# EAGLE design hddj-2.0 (EAGLE 4.16)
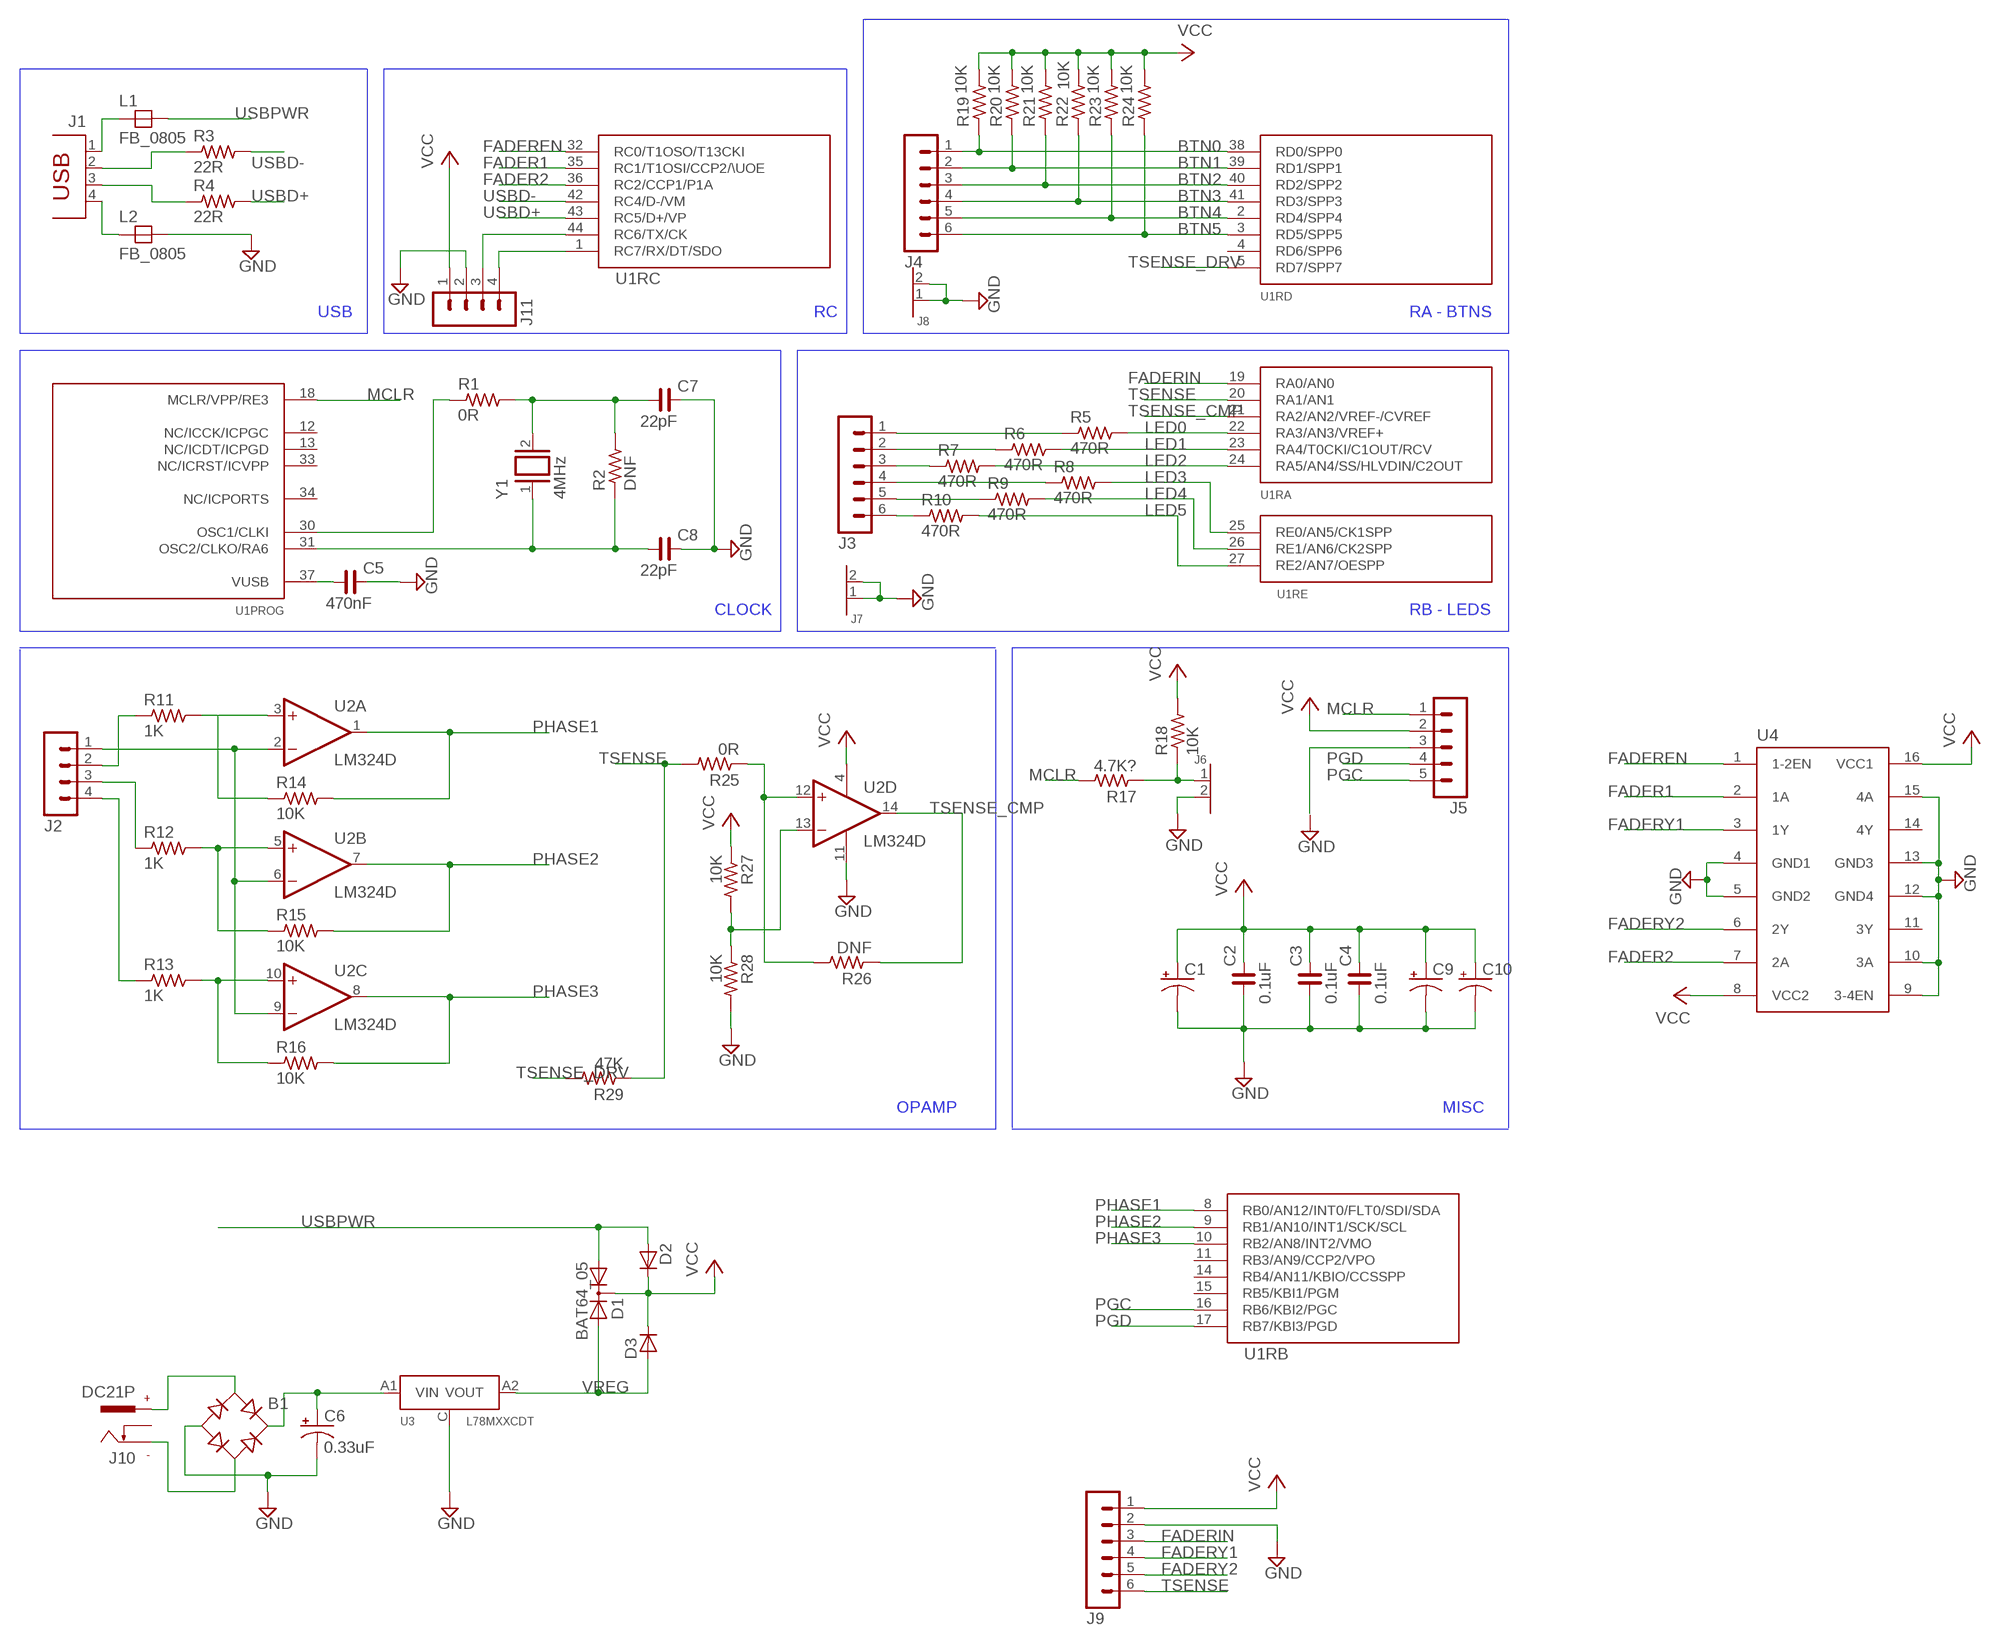
[diagram p0: schematic, sheet 1]

## Parts
B1  RB1A  [RB1A]
C1  CPOL-USCT3216  [CT3216]
C2  0.1uF  C_0805  [C0805]
C3  0.1uF  C_0805  [C0805]
C4  0.1uF  C_0805  [C0805]
C5  470nF  C_0805  [C0805]
C6  0.33uF  CPOL-USB/3528-21R  [B/3528-21R]
C7  22pF  C_0805  [C0805]
C8  22pF  C_0805  [C0805]
C9  CPOL-USCT3216  [CT3216]
C10  CPOL-USCT3216  [CT3216]
D1  BAT64_05  DIODE-2AC|CASOT23  [SOT23]
D2  D-SMB  [SMB]
D3  D-SMB  [SMB]
J1  PN61729  [PN61729]
J2  MA04-1  [MA04-1]
J3  MA06-1  [MA06-1]
J4  MA06-1  [MA06-1]
J5  MA05-1  [MA05-1]
J6  PINHDR2  [1X02]
J7  PINHDR2  [1X02]
J8  PINHDR2  [1X02]
J9  MA06-1  [MA06-1]
J10  DC21P  [DCSKTP]
J11  MA04-1  [MA04-1]
L1  FB_0805  [L0805]
L2  FB_0805  [L0805]
R1  0R  R_0805  [R0805]
R2  DNF  R_0805  [R0805]
R3  22R  R_0805  [R0805]
R4  22R  R_0805  [R0805]
R5  470R  R_0805  [R0805]
R6  470R  R_0805  [R0805]
R7  470R  R_0805  [R0805]
R8  470R  R_0805  [R0805]
R9  470R  R_0805  [R0805]
R10  470R  R_0805  [R0805]
R11  1K  R_0805  [R0805]
R12  1K  R_0805  [R0805]
R13  1K  R_0805  [R0805]
R14  10K  R_0805  [R0805]
R15  10K  R_0805  [R0805]
R16  10K  R_0805  [R0805]
R17  4.7K?  R_0805  [R0805]
R18  10K  R_0805  [R0805]
R19  10K  R_0805  [R0805]
R20  10K  R_0805  [R0805]
R21  10K  R_0805  [R0805]
R22  10K  R_0805  [R0805]
R23  10K  R_0805  [R0805]
R24  10K  R_0805  [R0805]
R25  0R  R_0805  [R0805]
R26  DNF  R_0805  [R0805]
R27  10K  R_0805  [R0805]
R28  10K  R_0805  [R0805]
R29  47K  R_0805  [R0805]
U1  PIC18F4550PT  [PQFP-44]
U2  LM324D  [SO14]
U3  L78MXXCDT  [DPACK_3]
U4  L293E  [DIL16]
Y1  4MHz  XTAL/S  [QS]

## Nets
BTN0: J4.1 R19.1 U1.38(RD:RD0/SPP0)
BTN1: J4.2 R20.1 U1.39(RD:RD1/SPP1)
BTN2: J4.3 R21.1 U1.40(RD:RD2/SPP2)
BTN3: J4.4 R22.1 U1.41(RD:RD3/SPP3)
BTN4: J4.5 R23.1 U1.2(RD:RD4/SPP4)
BTN5: J4.6 R24.1 U1.3(RD:RD5/SPP5)
FADER1: U1.35(RC:RC1/T1OSI/CCP2/\UOE) U4.2(1A)
FADER2: U1.36(RC:RC2/CCP1/P1A) U4.7(2A)
FADEREN: U1.32(RC:RC0/T1OSO/T13CKI) U4.1(1-2EN)
FADERIN: J9.3 U1.19(RA:RA0/AN0)
FADERY1: J9.4 U4.3(1Y)
FADERY2: J9.5 U4.6(2Y)
GND: B1.- C1.- C2.1 C3.1 C4.1 C5.2 C6.- C7.2 C8.2 C9.- C10.- J5.3 J6.2 J7.1 J7.2 J8.1 J8.2 J9.2 J11.2 L2.2 R28.2 U2.11(P:V-) U3.C(GND) U4.4(GND1) U4.5(GND2) U4.9(3-4EN) U4.10(3A) U4.12(GND4) U4.13(GND3) U4.15(4A)
LED0: R5.2 U1.22(RA:RA3/AN3/VREF+)
LED1: R6.2 U1.23(RA:RA4/T0CKI/C1OUT/RCV)
LED2: R7.2 U1.24(RA:RA5/AN4/SS/HLVDIN/C2OUT)
LED3: R8.2 U1.25(RE:RE0/AN5/CK1SPP)
LED4: R9.2 U1.26(RE:RE1/AN6/CK2SPP)
LED5: R10.2 U1.27(RE:RE2/AN7/OESPP)
MCLR: J5.1 R17.2 U1.18(PROG:MCLR/VPP/RE3)
N$1: J3.6 R10.1
N$2: R1.1 U1.30(PROG:OSC1/CLKI)
N$3: J3.5 R9.1
N$4: J3.4 R8.1
N$5: J3.3 R7.1
N$6: J3.2 R6.1
N$7: J3.1 R5.1
N$8: J6.1 R17.1 R18.1
N$9: J11.4 U1.1(RC:RC7/RX/DT/SDO)
N$10: J11.3 U1.44(RC:RC6/TX/CK)
N$11: R13.2 R16.1 U2.10(C:+IN)
N$12: R12.2 R15.1 U2.5(B:+IN)
N$13: R27.2 R28.1 U2.13(D:-IN)
N$14: C7.1 R1.2 R2.2 Y1.2
N$15: C8.1 R2.1 U1.31(PROG:OSC2/CLKO/RA6) Y1.1
N$16: C5.1 U1.37(PROG:VUSB)
N$17: J2.1 U2.2(A:-IN) U2.6(B:-IN) U2.9(C:-IN)
N$18: J1.4 L2.1
N$19: J2.2 R11.1
N$20: J2.3 R12.1
N$21: J2.4 R13.1
N$22: J1.3 R4.1
N$23: R25.1 R26.2 U2.12(D:+IN)
N$27: B1.AC1 J10.+
N$28: B1.AC2 J10.-
N$29: J1.2 R3.1
N$30: J1.1 L1.1
N$31: B1.+ C6.+ U3.A1(VIN)
N$55: R11.2 R14.1 U2.3(A:+IN)
PGC: J5.5 U1.16(RB:RB6/KBI2/PGC)
PGD: J5.4 U1.17(RB:RB7/KBI3/PGD)
PHASE1: R14.2 U1.8(RB:RB0/AN12/INT0/FLT0/SDI/SDA) U2.1(A:OUT)
PHASE2: R15.2 U1.9(RB:RB1/AN10/INT1/SCK/SCL) U2.7(B:OUT)
PHASE3: R16.2 U1.10(RB:RB2/AN8/INT2/VMO) U2.8(C:OUT)
TSENSE: J9.6 R25.2 R29.1 U1.20(RA:RA1/AN1)
TSENSE_CMP: R26.1 U1.21(RA:RA2/AN2/VREF-/CVREF) U2.14(D:OUT)
TSENSE_DRV: R29.2 U1.5(RD:RD7/SPP7)
USBD+: R4.2 U1.43(RC:RC5/D+/VP)
USBD-: R3.2 U1.42(RC:RC4/D-/VM)
USBPWR: D1.1(A1) D2.2(A) L1.2
VCC: C1.+ C2.2 C3.2 C4.2 C9.+ C10.+ D1.3(C) D2.1(C) D3.1(C) J5.2 J9.1 J11.1 R18.2 R19.2 R20.2 R21.2 R22.2 R23.2 R24.2 R27.1 U2.4(P:V+) U4.8(VCC2) U4.16(VCC1)
VREG: D1.2(A2) D3.2(A) U3.A2(VOUT)
Unconnected: J10.C U1.4(RD:RD6/SPP6) U1.11(RB:RB3/AN9/CCP2/VPO) U1.12(PROG:NC/ICCK/ICPGC) U1.13(PROG:NC/ICDT/ICPGD) U1.14(RB:RB4/AN11/KBIO/CCSSPP) U1.15(RB:RB5/KBI1/PGM) U1.33(PROG:NC/ICRST/ICVPP) U1.34(PROG:NC/ICPORTS) U4.11(3Y) U4.14(4Y)

## Notes on the sheet
- USB | RC | RA - BTNS
- CLOCK | RB - LEDS
- OPAMP | MISC

## Power pins joined to a net without a drawn wire
GND: U1.6(GND) U1.29(GND)
VCC: U1.7(VCC) U1.28(VCC)

## Library data of the parts
B1 = rectifier:RB1A: RECTIFIER 1 A
C1 C6 C9 C10 = rcl:CPOL-US: POLARIZED CAPACITOR, American symbol
C2-C5 C7 C8 = rc-master:C_: NON-POLARIZED CAP
D1 = diode:DIODE-2AC|CA: Dual DIODE Anode-Cathode|Cathode-Anode
D2 D3 = semicon-smd-ipc:D-: DIODE unfilled
J1 = con-berg:PN61729: BERG USB connector
J2 J11 = con-lstb:MA04-1: PIN HEADER
J3 J4 J9 = con-lstb:MA06-1: PIN HEADER
J5 = con-lstb:MA05-1: PIN HEADER
J6-J8 = dongle:PINHDR2
J10 = dcsocket:DC21P: DC 2.1 mm Power Socket Positive Centre
L1 L2 = rc-master:FB_: FERRITE BEAD
R1-R29 = rc-master:R_: RESISTOR
U1 = dongle:PIC18F4550
U2 = linear:LM324: OP AMP
U3 = dongle:L78MXX
U4 = texas:L293E: TI DEVICE
Y1 = special:XTAL/S: CRYSTAL

## Board
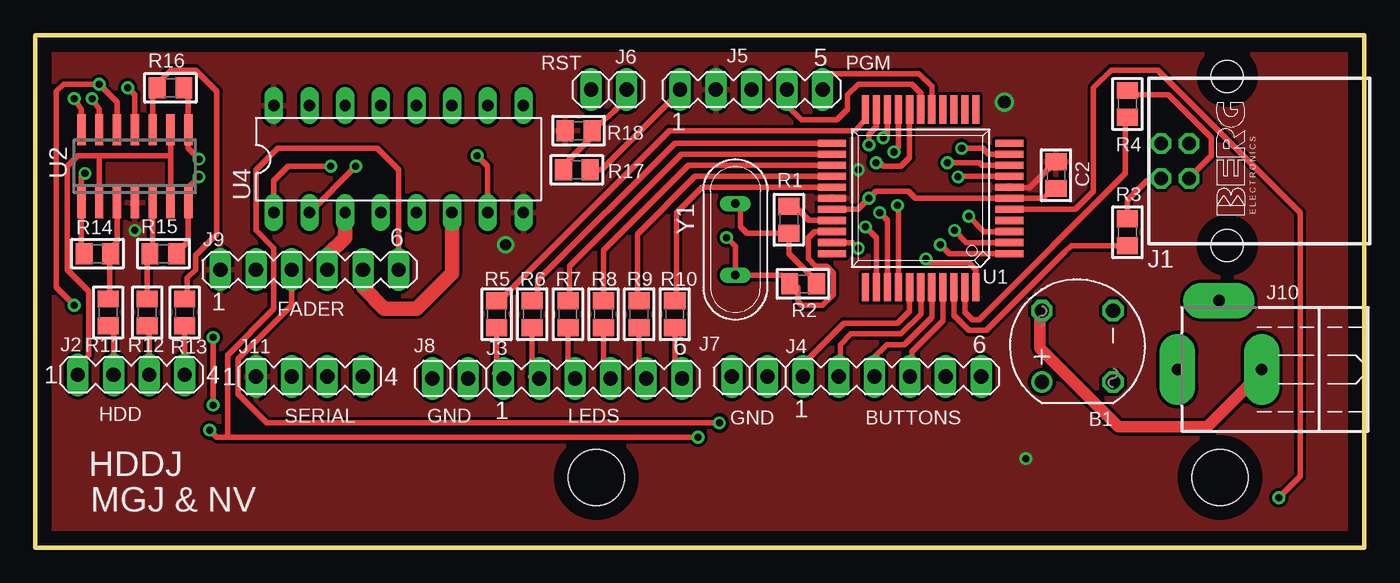
[diagram p1: board, top side]
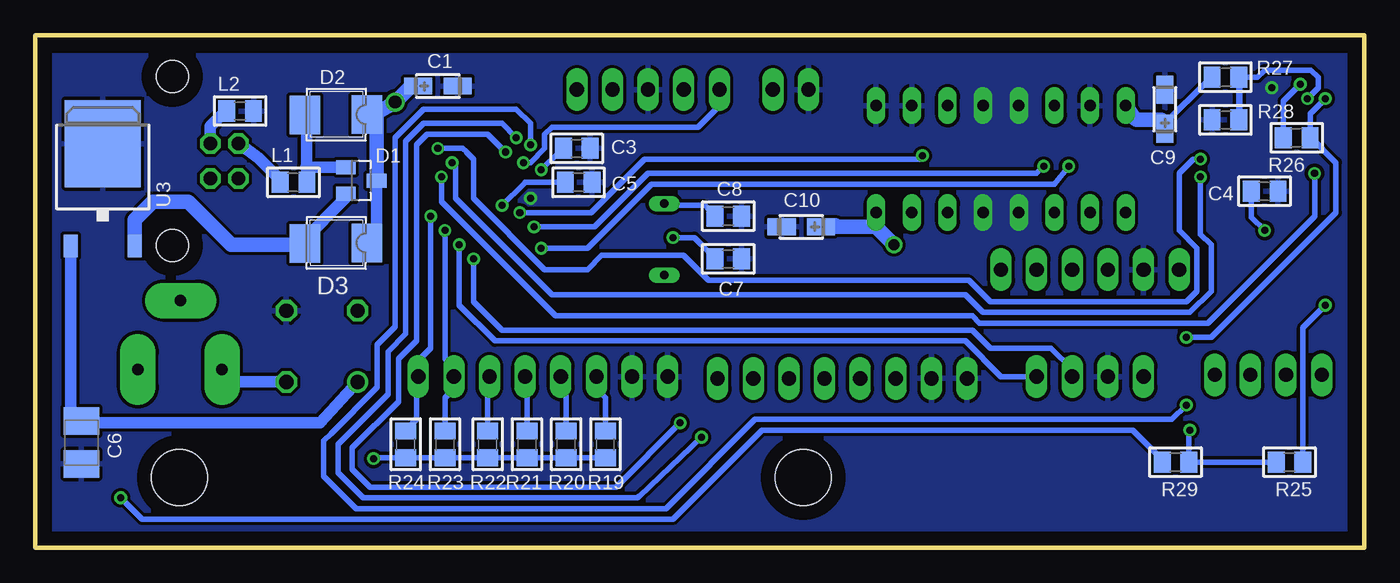
[diagram p2: board, bottom side, seen from below]

Size 94.75 x 36.52 mm. Coordinates in mm from the lower left corner, seen from the top.
Outline: 0,0 0,36.52 94.75,36.52 94.75,0 0,0
Copper layers (1*16): Top 0.035mm / dielectric 1.5mm / Bottom 0.035mm
Design rules "default": minimum track width 10mil, minimum drill 12mil, track to track 9mil, track to pad 9mil, pad to pad 9mil, via to via 9mil, smd to smd 8mil, copper to edge 40mil, drill to drill 8mil, minimum pad ring 10mil, minimum via ring 8mil, stop-mask expansion 4mil, vias tented up to drill 0mil, thermal gap 10mil
Holes 4 mm at 40,5 84.45,5

### Footprints (pad centres in the part's own frame; a part is rotated, then mirrored left to right if it is on the bottom)
RB1A = drill 1.016 round: + -2.54,2.54 | drill 1.016 octagon: - 2.54,-2.54; AC1 2.54,2.54; AC2 -2.54,-2.54
CT3216 = smd 2 x 1.2: + 1.4,0; - -1.4,0
C0805 = smd 1.2 x 1.5: 1 -0.953,0; 2 0.953,0
B/3528-21R = smd 1.95 x 2.5: + 1.525,0; - -1.525,0
SOT23 = smd 1 x 1.4: 1 -0.95,-1.1; 2 0.95,-1.1; 3 0,1.1
SMB = smd 2.159 x 2.743: 1 -2.311,-0.127; 2 2.108,-0.102
PN61729 = drill 0.95 octagon: 1 1.25,4.71; 2 -1.25,4.71; 3 -1.25,2.71; 4 1.25,2.71 | hole 2.3: -6.02,0; 6.02,0
MA04-1 = drill 1.016 long: 1 -3.81,0; 2 -1.27,0; 3 1.27,0; 4 3.81,0
MA06-1 = drill 1.016 long: 1 -6.35,0; 2 -3.81,0; 3 -1.27,0; 4 1.27,0; 5 3.81,0; 6 6.35,0
MA05-1 = drill 1.016 long: 1 -5.08,0; 2 -2.54,0; 3 0,0; 4 2.54,0; 5 5.08,0
1X02 = drill 1.016 long: 1 -1.27,0; 2 1.27,0
DCSKTP = drill 0.813 pad 2.54 long: + -1.27,0.08; - -1.27,6.08; C 3.63,3.13
L0805 = smd 1.2 x 1.5: 1 -0.953,0; 2 0.953,0
R0805 = smd 1.2 x 1.5: 1 -0.953,0; 2 0.953,0
PQFP-44 = smd 0.508 x 2.007: 1 -3.937,-6.706; 2 -3.15,-6.706; 3 -2.362,-6.706; 4 -1.575,-6.706; 5 -0.787,-6.706; 6 0,-6.706; 7 0.787,-6.706; 8 1.575,-6.706; 9 2.362,-6.706; 10 3.15,-6.706; 11 3.937,-6.706; 23 3.937,5.944; 24 3.15,5.944; 25 2.362,5.944; 26 1.575,5.944; 27 0.787,5.944; 28 0,5.944; 29 -0.787,5.944; 30 -1.575,5.944; 31 -2.362,5.944; 32 -3.15,5.944; 33 -3.937,5.944 | smd 2.007 x 0.508: 12 6.325,-4.318; 13 6.325,-3.531; 14 6.325,-2.743; 15 6.325,-1.956; 16 6.325,-1.168; 17 6.325,-0.381; 18 6.325,0.406; 19 6.325,1.194; 20 6.325,1.981; 21 6.325,2.769; 22 6.325,3.556; 34 -6.325,3.556; 35 -6.325,2.769; 36 -6.325,1.981; 37 -6.325,1.194; 38 -6.325,0.406; 39 -6.325,-0.381; 40 -6.325,-1.168; 41 -6.325,-1.956; 42 -6.325,-2.743; 43 -6.325,-3.531; 44 -6.325,-4.318
SO14 = smd 0.6 x 2.2: 1 -3.81,-2.6; 2 -2.54,-2.6; 3 -1.27,-2.6; 4 0,-2.6; 5 1.27,-2.6; 6 2.54,-2.6; 7 3.81,-2.6; 8 3.81,2.6; 9 2.54,2.6; 10 1.27,2.6; 11 0,2.6; 12 -1.27,2.6; 13 -2.54,2.6; 14 -3.81,2.6
DPACK_3 = smd 1 x 1.6: A1 -2.28,-4.8; A2 2.28,-4.8 | smd 5.4 x 6.2: C 0,2.5
DIL16 = drill 0.813 long: 1 -8.89,-3.81; 2 -6.35,-3.81; 3 -3.81,-3.81; 4 -1.27,-3.81; 5 1.27,-3.81; 6 3.81,-3.81; 7 6.35,-3.81; 8 8.89,-3.81; 9 8.89,3.81; 10 6.35,3.81; 11 3.81,3.81; 12 1.27,3.81; 13 -1.27,3.81; 14 -3.81,3.81; 15 -6.35,3.81; 16 -8.89,3.81
QS = drill 0.61 long: 1 -2.54,0; 2 2.54,0

### Placement (x,y rotation side)
B1  74.3,14.35 90 top
C1  66.04,32.89 180 bottom
C2  72.77,26.54 90 top
C3  56.13,28.45 180 bottom
C4  7.11,25.4 180 bottom
C5  56.01,26.04 0 bottom
C6  91.44,7.49 90 bottom
C7  45.34,23.62 0 bottom
C8  45.34,20.57 0 bottom
C9  14.22,31.24 270 bottom
C10  40.13,22.86 0 bottom
D1  71.5,26.16 270 bottom
D2  73.41,30.73 180 bottom
D3  73.41,21.59 180 bottom
J1  84.96,27.56 90 top
J2  6.86,12.32 0 top
J3  39.75,12.06 0 top
J4  61.09,12.19 0 top
J5  51.05,32.64 0 top
J6  40.89,32.64 180 top
J7  50.93,12.19 0 top
J8  29.59,12.06 0 top
J9  19.56,19.81 0 top
J10  87.5,13.97 90 top
J11  19.56,12.19 0 top
L1  76.33,26.04 0 bottom
L2  80.14,31.11 0 bottom
R1  53.72,23.37 270 top
R2  54.74,18.8 0 top
R3  77.85,22.48 270 top
R4  77.85,31.62 270 top
R5  32.89,16.64 90 top
R6  35.43,16.64 90 top
R7  37.97,16.64 90 top
R8  40.51,16.64 90 top
R9  43.05,16.64 90 top
R10  45.59,16.64 90 top
R11  5.21,16.76 90 top
R12  8,16.76 90 top
R13  10.67,16.76 90 top
R14  4.45,20.95 180 top
R15  9.14,20.95 0 top
R16  9.65,32.77 0 top
R17  38.61,26.92 0 top
R18  38.73,29.72 180 top
R19  54.1,7.37 270 bottom
R20  56.9,7.37 270 bottom
R21  59.69,7.37 270 bottom
R22  62.48,7.37 270 bottom
R23  65.53,7.37 270 bottom
R24  68.33,7.37 270 bottom
R25  5.33,6.1 180 bottom
R26  4.83,29.21 180 bottom
R27  9.91,33.53 0 bottom
R28  9.91,30.48 180 bottom
R29  13.46,6.1 180 bottom
U1  62.74,24.89 90 top
U2  7.11,27.18 0 top
U3  89.92,26.29 0 bottom
U4  25.91,27.69 0 top
Y1  49.91,21.97 90 top

### Tracks (layer width: path | path; a pad name or v marks a point on that pad's centre or on a via)
BTN0
  Top 0.406: U1.38 62.33,16.87 61.47,16 57.66,16 55.12,13.46 54.86,12.45 54.61,12.19 J4.1
  Bottom 0.406: R19.1 54.1,10.67 54.61,11.18 54.61,11.94 54.86,12.19 J4.1
BTN1
  Top 0.406: U1.39 63.12,16.64 61.72,15.24 58.17,15.24 57.4,14.48 57.4,12.45 57.28,12.32 J4.2
  Bottom 0.406: R20.1 56.9,11.18 57.15,11.43 57.15,12.19 J4.2
BTN2
  Top 0.406: J4.3 59.94,12.19 59.94,12.7 59.69,13.46 | 59.69,13.46 59.69,12.95 | U1.40 63.91,16.41 61.98,14.48 60.71,14.48 59.69,13.46
  Bottom 0.406: 59.82,12.32 59.94,12.45 | 59.82,12.32 J4.3 | R21.1 59.69,12.19 59.82,12.32
BTN3
  Top 0.406: 62.48,12.45 62.36,12.32 J4.4 62.36,12.06 62.48,11.94 62.48,13.97 64.69,16.18 U1.41
  Bottom 0.406: J4.4 62.23,12.19 62.48,11.94 R22.1
BTN4  (via drill 0.5)
  Top 0.406: U1.2 66.4,21.74 v65.53,22.61
  Bottom 0.406: R23.1 65.53,10.67 64.77,11.43 64.77,11.94 65.02,12.19 | 65.02,12.19 J4.5 | 65.02,12.19 65.02,12.7 65.28,12.95 65.28,13.21 65.53,13.46 v65.53,22.61
BTN5  (via drill 0.5)
  Top 0.406: U1.3 67.64,22.53 v66.55,23.62
  Bottom 0.406: 67.56,12.45 67.44,12.32 J4.6 67.44,12.06 67.31,11.94 67.56,11.68 67.56,9.14 68.33,8.38 R24.1 | 67.56,12.45 67.56,11.43 | 67.56,12.45 67.56,13.21 66.55,14.22 v66.55,23.62
FADER1  (via drill 0.5)
  Top 0.406: U1.35 59.97,22.07 v59.18,22.86 | U4.2 v22.86,27.18
  Bottom 0.406: v59.18,22.86 54.86,22.86 51.05,26.67 23.37,26.67 v22.86,27.18
FADER2  (via drill 0.5)
  Top 0.406: U1.36 60.76,23.32 v60.2,23.88 | U4.7 32.26,27.18 v31.5,27.94
  Bottom 0.406: v60.2,23.88 55.12,23.88 51.31,27.69 31.5,27.69 v31.5,27.94
FADEREN  (via drill 0.5)
  Top 0.406: U1.32 58.27,21.74 v58.67,21.34 | 17.27,23.88 17.27,23.11 U4.1 17.02,26.16 18.03,27.18 v21.08,27.18
  Bottom 0.406: v58.67,21.34 55.37,21.34 50.8,25.91 22.1,25.91 v21.08,27.18
FADERIN  (via drill 0.5)
  Top 0.406: U1.19 61.54,28.52 v61.21,28.19 | v48.77,8.89 16.51,8.89 14.48,10.92 14.48,13.46 18.29,17.27 J9.3
  Bottom 0.406: v61.21,28.19 62.48,29.46 66.8,29.46 67.56,28.7 67.56,14.73 68.83,13.46 68.83,10.41 72.14,7.11 72.14,5.59 70.87,4.32 53.34,4.32 v48.77,8.89
FADERY1
  Top 1.016: U4.3 22.1,22.1 20.83,20.83 20.83,20.07 21.08,19.81 J9.4
FADERY2
  Top 1.016: J9.5 23.37,18.54 24.89,17.02 27.18,17.02 29.72,19.56 U4.6 29.72,23.11
GND  (via drill 0.5)
  Top 0.406: U1.29 58.65,24.11 v59.44,24.89 59.94,25.4 62.23,25.4 62.74,24.89 U1.6 71.88,24.89 72.58,25.59 C2.1 | U2.11 7.11,32.26 v6.6,32.77
  pour Bottom: -0.25,35.05 0,0 94.61,0 94.61,35.05
  pour Bottom (no thermals): 23.37,33.27 23.37,20.57 28.45,20.57 28.45,33.27 28.19,33.53 23.62,33.53
LED0
  Top 0.406: 32.89,17.4 32.77,17.27 | R5.2 32.89,17.4 | 32.89,17.4 45.21,29.72 58.42,29.72 59.18,30.48 U1.22 59.18,31.24
LED1
  Top 0.406: R6.2 35.43,17.65 35.81,18.03 35.81,19.05 45.59,28.83 U1.23
LED2
  Top 0.406: 37.91,17.59 37.85,17.53 | R7.2 37.91,17.59 | 37.91,17.59 38.1,17.78 38.1,20.07 46.08,28.04 U1.24
LED3
  Top 0.406: U1.25 46.56,27.25 40.51,21.21 R8.2
LED4
  Top 0.406: R9.2 42.99,17.59 42.93,17.53 42.93,22.35 47.04,26.47 U1.26
LED5
  Top 0.406: 45.53,17.59 45.47,17.53 | 45.53,17.59 R10.2 45.59,17.4 | 45.53,17.59 45.72,17.78 | U1.27 47.52,25.68 45.72,23.88 45.72,17.53 45.59,17.4 | 45.59,17.4 45.47,17.27
MCLR  (via drill 0.5)
  Top 0.406: J5.1 45.97,32.51 40.39,26.92 R17.2 | U1.18 62.33,27.79 61.72,27.18 60.45,27.18 60.2,27.43 v59.94,27.43
  Bottom 0.406: J5.1 45.97,31.5 47.5,29.97 57.91,29.97 58.42,29.46 58.42,28.45 59.44,27.43 v59.94,27.43
N$1
  Top 0.406: R10.1 45.59,12.32 45.85,12.06 J3.6
N$2
  Top 0.406: R1.1 54.17,24.32 55.17,23.32 U1.30
N$3
  Top 0.406: R9.1 43.05,12.32 43.31,12.32 J3.5
N$4
  Top 0.406: R8.1 40.51,12.57 J3.4 41.15,11.94
N$5
  Top 0.406: J3.3 38.61,12.19 37.97,12.83 R7.1
N$6
  Top 0.406: J3.2 35.31,12.19 35.43,12.32 R6.1
N$7
  Top 0.406: J3.1 32.89,12.32 32.77,12.45 32.89,12.57 R5.1
N$8
  Top 0.406: J6.1 42.16,32.77 41.91,32.51 41.91,31.75 41.21,31.05 R18.1 39.62,29.72 39.62,29.21 37.66,27.24 R17.1
N$9  (via drill 0.5)
  Top 0.406: U1.1 65.15,20.95 v64.52,21.59
  Bottom 0.406: J11.4 25.91,12.19 28.45,14.73 61.98,14.73 64.52,17.27 v64.52,21.59
N$10  (via drill 0.5)
  Top 0.406: U1.44 67.06,19.81 66.55,20.32 63.75,20.32 v63.5,20.57
  Bottom 0.406: v63.5,20.57 63.5,17.53 61.47,15.49 27.94,15.49 26.67,14.22 22.35,14.22 20.83,12.7 J11.3
N$11
  Top 0.406: R13.2 10.86,17.72 10.86,19.24 11.43,19.81 11.43,20.83 12.95,22.35 12.95,32.51 11.43,34.04 9.65,34.04 8.38,32.77 U2.10 8.38,32.51 8.64,32.77 R16.1
N$12
  Top 0.406: 8.26,20.95 8.38,21.08 | 8.26,20.95 R15.1 8.19,21.02 8.13,21.08 8.38,21.34 U2.5 | R12.2 8,20.7 8.26,20.95
N$13  (via drill 0.5)
  Top 0.406: U2.13 4.57,31.24 v4.06,32
  Bottom 0.406: 8.89,30.48 R28.1 | R27.2 8.95,30.54 8.89,30.48 | 8.89,30.48 8.89,33.53 7.62,33.53 7.11,34.04 3.81,34.04 3.3,33.53 3.3,32.77 v4.06,32
N$14
  Top 0.406: Y1.2 50.29,24.64 50.29,22.86 50.74,22.42 R1.2 53.72,20.95 55.88,18.8 R2.2
  Bottom 0.406: C7.1 46.99,24.38 50.04,24.38 Y1.2
N$15  (via drill 0.5)
  Top 0.406: U1.31 55.55,22.53 55.12,22.1 55.12,20.57 55.63,20.07 56.39,20.07 56.9,19.56 56.9,18.03 56.13,17.27 54.61,17.27 54.36,17.53 54.36,18.54 54.29,18.61 R2.1 53.85,18.8 53.21,19.43 Y1.1 49.91,21.46 v49.28,22.1
  Bottom 0.406: v49.28,22.1 47.75,22.1 47.24,21.59 C8.1
N$16  (via drill 0.5)
  Top 0.406: U1.37 61.54,24.56 v61.47,24.38
  Bottom 0.406: v61.47,24.38 59.94,25.91 59.82,26.04 C5.1
N$17
  Top 0.406: 9.65,27.94 U2.9 | 9.65,27.94 U2.6 | 4.57,27.94 3.05,27.94 2.29,27.18 2.29,19.81 3.81,18.29 3.81,13.72 3.05,12.95 J2.1 | 4.57,27.94 9.65,27.94 | 4.57,27.94 U2.2
N$18
  Bottom 0.813: 81.09,31.18 81.03,31.24 | 81.09,31.18 L2.1 | J1.4 82.25,30.02 81.09,31.18
N$19
  Top 0.406: R11.1 5.21,15.88 5.33,16 5.59,15.75 J2.2
N$20
  Top 0.406: R12.1 7.94,15.81 7.87,15.75 8.13,15.49 J2.3
N$21
  Top 0.406: R13.1 10.48,15.81 10.41,15.75 10.67,15.49 J2.4
N$22
  Top 0.406: J1.3 82.25,26.37 83.82,27.94 83.82,29.21 80.77,32.26 78.49,32.26 78.17,32.58 R4.1
N$23  (via drill 0.5)
  Top 0.406: U2.12 5.84,31.75 v4.57,33.02 2.03,33.02 1.52,32.51 1.52,18.54 v2.79,17.27
  Bottom 0.406: R26.2 5.78,31.81 v4.57,33.02 | v2.79,17.27 4.38,15.68 4.38,6.16 4.32,6.1 R25.1
N$27
  Top 0.813: J10.+ 87.42,12.49 83.57,8.64 77.22,8.64 71.63,14.22 71.63,17.02 B1.AC1
  Bottom 0.813: J10.+ 87.42,12.49
N$28
  Bottom 0.813: J10.- 81.53,12.7 80.64,11.81 B1.AC2
N$29
  Top 0.406: 80.26,26.16 80.25,26.17 | 80.26,26.16 79.25,26.16 77.85,24.77 R3.1 | 80.26,26.16 80.26,26.42 80.25,26.41 J1.2
N$30
  Bottom 0.813: L1.1 77.28,26.1 77.22,26.16 78.85,27.79 J1.1
N$31
  Bottom 0.813: U3.A1 92.2,21.58 92.2,21.59 92.2,9.4 91.95,9.14 91.69,9.14 91.44,8.89 | B1.+ 74.42,8.89 91.19,8.89 91.44,9.14 C6.+ 91.44,8.89 | 91.44,8.89 91.19,8.64
N$55
  Top 0.406: U2.3 5.84,21.84 5.33,21.34 | R11.2 5.27,17.72 5.33,17.78 5.33,21.34 | R14.1 5.4,21.27 5.33,21.34
PGC
  Top 0.406: U1.16 63.91,32.87 62.99,33.78 56.39,33.78 55.88,32.26 56.01,32.13 J5.5
PGD
  Top 0.406: J5.4 53.59,31.5 54.61,30.48 57.15,30.48 57.91,31.24 57.91,32.26 58.67,33.02 62.48,33.02 63.12,32.38 U1.17
PHASE1  (via drill 0.5)
  Top 0.406: R14.2 3.49,21.02 3.56,21.08 3.3,21.34 | 3.3,21.34 U2.1 | 3.3,21.34 3.3,26.42 v3.56,26.67 | U1.8 66.09,26.47 v65.79,26.42
  Bottom 0.406: 65.53,26.42 v65.79,26.42 65.79,24.64 65.53,24.38 57.66,16.51 27.94,16.51 27.43,16 11.18,16 3.56,23.62 v3.56,26.67
PHASE2  (via drill 0.5)
  Top 0.406: R15.2 10.1,21.02 10.92,21.84 U2.7 10.92,25.65 v11.68,26.42 | v65.02,27.43 67.31,27.43 67.49,27.25 U1.9
  Bottom 0.406: v11.68,26.42 11.68,22.35 10.92,21.59 10.92,18.29 12.45,16.76 27.18,16.76 28.45,18.03 57.91,18.03 64.77,24.89 64.77,27.18 v65.02,27.43
PHASE3  (via drill 0.5)
  Top 0.406: R16.2 10.41,32.77 10.92,32.26 U2.8 10.92,28.45 v11.68,27.69 | U1.10 67.97,28.04 67.56,28.45 v66.04,28.45
  Bottom 0.406: v11.68,27.69 12.19,27.69 13.21,26.67 13.21,22.61 11.94,21.34 11.94,18.29 12.7,17.53 26.67,17.53 28.19,19.05 46.74,19.05 48.51,20.83 54.36,20.83 55.37,19.81 58.42,19.81 63.5,24.89 63.5,27.69 64.01,28.19 63.99,28.21 64.26,28.45 v66.04,28.45
TSENSE  (via drill 0.5)
  Top 0.406: J9.6 25.91,26.92 24.38,28.45 17.27,28.45 15.75,26.92 15.75,22.61 17.02,21.34 17.02,17.02 13.72,13.72 13.72,7.87 | U1.20 60.76,29.52 v60.45,29.21 | v47.24,7.87 47.24,7.62 46.99,7.87 13.72,7.87 | 13.72,7.87 12.95,7.87 v12.45,8.38
  Bottom 0.406: v60.45,29.21 61.47,30.23 67.06,30.23 68.33,28.96 68.33,15.24 69.6,13.97 69.6,10.92 73.15,7.37 73.15,5.33 71.37,3.56 51.82,3.56 51.71,3.66 51.66,3.66 | v47.24,7.87 51.66,3.66 | 51.66,3.66 | R25.2 R29.1 12.51,8.32 v12.45,8.38
TSENSE_CMP  (via drill 0.5)
  Top 0.406: U2.14 3.3,31.24 v2.79,32 | U1.21 59.97,30 59.44,29.46 v59.44,28.7 | v12.7,10.16 v12.7,14.99
  Bottom 0.406: 3.87,30.92 R26.1 | 3.87,30.92 v2.79,32 | v59.44,28.7 59.44,30.23 60.45,31.24 67.06,31.24 69.09,29.21 69.09,15.75 70.36,14.48 70.36,11.43 73.66,8.13 74.17,7.62 74.17,5.08 71.88,2.79 49.78,2.79 43.43,9.14 13.72,9.14 v12.7,10.16 | 3.87,30.92 3.87,29.27 2.03,27.43 2.03,23.88 10.92,14.99 v12.7,14.99
TSENSE_DRV  (via drill 0.5)
  Top 0.406: U1.5 74.14,24.11 75.44,25.4 75.44,32.77 76.71,34.04 80.01,34.04 90.17,23.88 90.17,5.08 v88.65,3.56
  Bottom 0.406: v88.65,3.56 87.12,2.03 49.28,2.03 42.93,8.38 16.51,8.38 14.22,6.1 R29.2
USBD+
  Top 0.406: U1.43 66.27,16.79 66.8,16.26 67.31,16.26 77.72,26.67 77.72,30.73 77.79,30.67 R4.2
USBD-
  Top 0.406: U1.42 65.48,16.56 66.55,15.49 67.82,15.49 73.41,21.08 73.85,21.53 R3.2
USBPWR
  Bottom 0.813: D2.2 75.51,30.91 75.44,30.99 75.37,30.92 75.37,27.18 | 75.37,27.18 L1.2 | 75.37,27.18 75.44,27.18 75.37,27.11 D1.1
VCC  (via drill 0.5, 0.8, 0.9)
  Top 0.406: C2.2 72.71,27.5 70.87,25.65 69.6,25.65 69.57,25.68 U1.7
  Bottom 0.406: C4.2 8.06,23.56 v7.11,22.61 | R20.2 56.83,6.41 56.64,6.6 | R20.2 R21.2 59.69,6.6 59.88,6.41 R22.2 62.48,6.35 62.55,6.41 R23.2 65.53,6.35 65.6,6.41 R24.2 70.55,6.41 v70.61,6.35 | R20.2 54.8,6.41 54.61,6.6 54.1,6.6 R19.2 | C3.2 57.4,28.19 v58.67,26.92 | R27.1 11.18,33.27 14.22,30.23
  Bottom 0.813: D3.1 70.74,21.72 70.61,21.59 70.4,21.8 D1.3 70.4,30.52 70.87,30.99 70.99,30.86 D2.1
  Bottom 1.016: C10.+ 37.72,22.98 37.59,22.86 34.8,22.86 | C9.+ 14.22,30.23 14.48,30.48 16.26,30.48 16.51,30.73 U4.16 | v33.53,21.59 34.8,22.86 | 34.8,22.86 U4.8 | D2.1 71.09,31.01 | D1.3 70.4,30.69 70.36,30.99 v69.09,31.75 67.94,32.89 C1.+
  pour Top: 0,35.94 0,0 95.12,0 94.61,36.45
VREG
  Bottom 0.813: 87.64,22.09 U3.A2 | D3.2 75.54,21.69 75.69,21.84 72.6,24.93 D1.2
  Bottom 1.016: 87.64,22.09 87.64,23.36 86.36,24.64 83.82,24.64 80.77,21.59 75.69,21.59 75.59,21.69 D3.2

### Text on the board
tNames: RST | PGM | FADER | HDD | SERIAL | GND | LEDS | GND | BUTTONS | HDDJ | MGJ & NV